# Altium schematic sheet 12_USB3_0_power.SchDoc: USB3.0 power
size A4; Organization: Lime Microsystems; Address1: Surrey Tech Centre; Address2: Guildford GU2 7YG; Address3: Surray; Address4: United Kingdom; Revision: v1.2; SheetNumber: 12; SheetTotal: 14
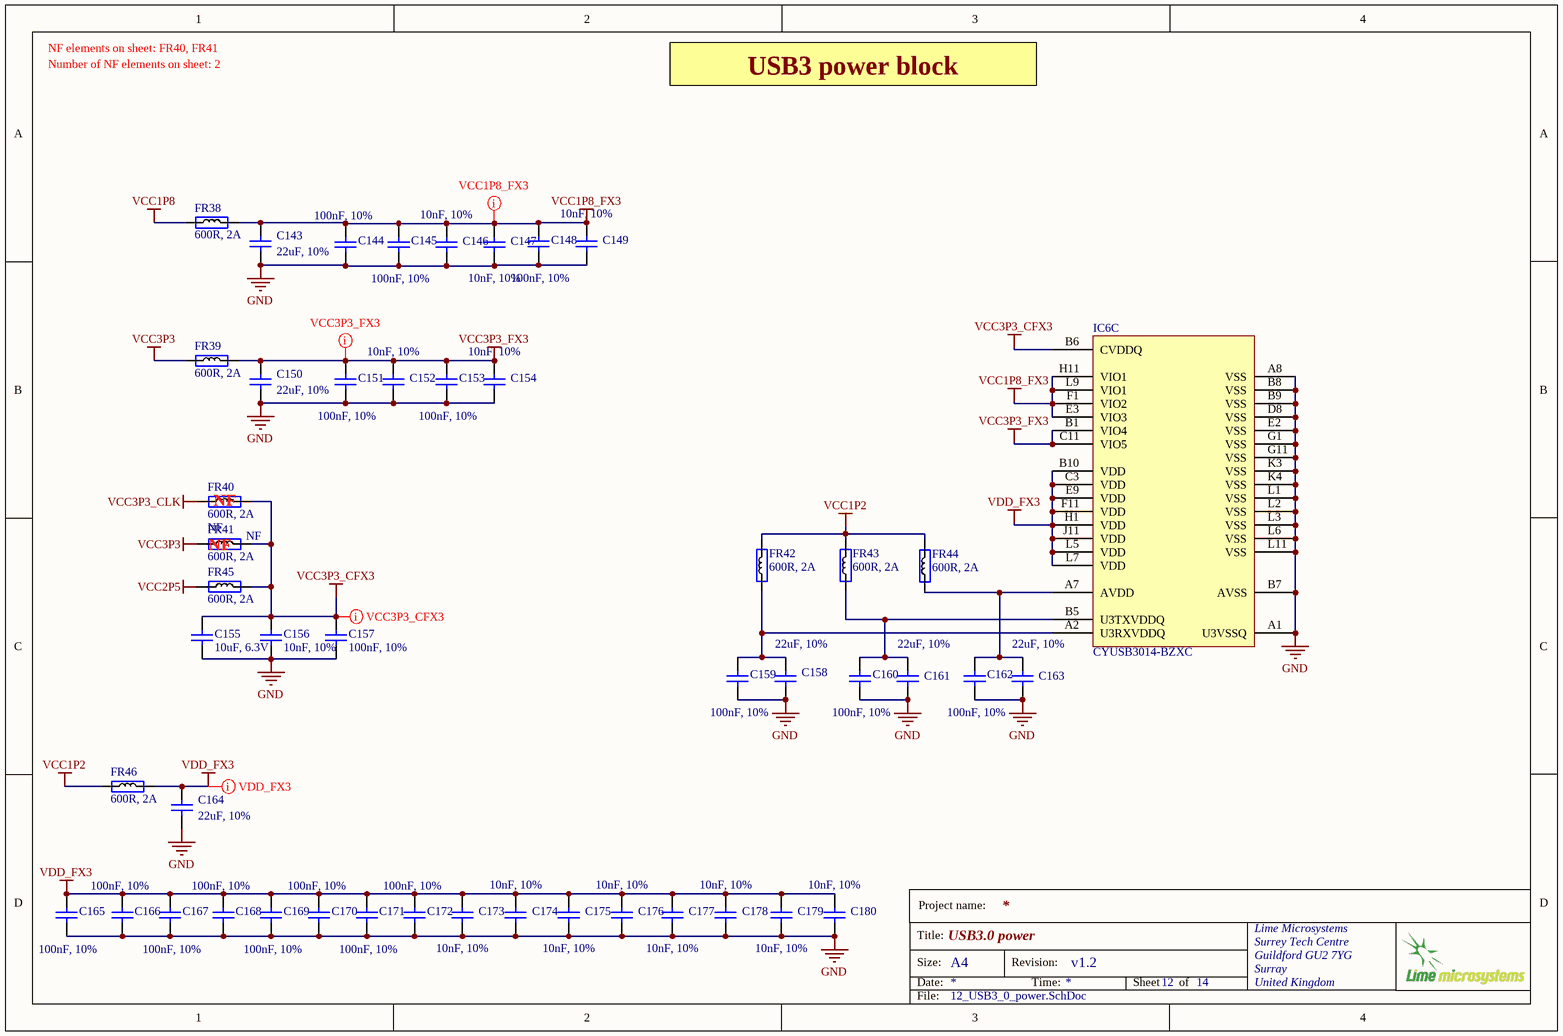
[diagram p0: 12_USB3_0_power.SchDoc]

## Parts
C143  22uF, 10%  [CAP0603]
C144  100nF, 10%  [CAP0402]
C145  100nF, 10%  [CAP0402]
C146  10nF, 10%  [CAP0402]
C147  10nF, 10%  [CAP0402]
C148  100nF, 10%  [CAP0402]
C149  10nF, 10%  [CAP0402]
C150  22uF, 10%  [CAP0603]
C151  100nF, 10%  [CAP0402]
C152  10nF, 10%  [CAP0402]
C153  100nF, 10%  [CAP0402]
C154  10nF, 10%  [CAP0402]
C155  10uF, 6.3V  [CAP0603]
C156  10nF, 10%  [CAP0402]
C157  100nF, 10%  [CAP0402]
C158  22uF, 10%  [CAP0603]
C159  100nF, 10%  [CAP0402]
C160  100nF, 10%  [CAP0402]
C161  22uF, 10%  [CAP0603]
C162  100nF, 10%  [CAP0402]
C163  22uF, 10%  [CAP0603]
C164  22uF, 10%  [CAP0603]
C165  100nF, 10%  [CAP0402]
C166  100nF, 10%  [CAP0402]
C167  100nF, 10%  [CAP0402]
C168  100nF, 10%  [CAP0402]
C169  100nF, 10%  [CAP0402]
C170  100nF, 10%  [CAP0402]
C171  100nF, 10%  [CAP0402]
C172  100nF, 10%  [CAP0402]
C173  10nF, 10%  [CAP0402]
C174  10nF, 10%  [CAP0402]
C175  10nF, 10%  [CAP0402]
C176  10nF, 10%  [CAP0402]
C177  10nF, 10%  [CAP0402]
C178  10nF, 10%  [CAP0402]
C179  10nF, 10%  [CAP0402]
C180  10nF, 10%  [CAP0402]
FR38  600R, 2A  [RES0805]
FR39  600R, 2A  [RES0805]
FR40  600R, 2A  Assembly Info: NF  [RES0805]
FR41  600R, 2A  Assembly Info: NF  [RES0805]
FR42  600R, 2A  [RES0805]
FR43  600R, 2A  [RES0805]
FR44  600R, 2A  [RES0805]
FR45  600R, 2A  [RES0805]
FR46  600R, 2A  [RES0805]
IC6  CYUSB3014-BZXC  [CYP-BZX121]  (part C of 3)

## Nets
GND: C143.1 C144.2 C145.2 C146.1 C147.1 C148.2 C149.1 C150.1 C151.2 C152.1 C153.2 C154.1 C155.1 C156.1 C157.2 C158.1 C159.2 C160.2 C161.1 C162.2 C163.1 C164.1 C165.2 C166.2 C167.2 C168.2 C169.2 C170.2 C171.2 C172.2 C173.1 C174.1 C175.1 C176.1 C177.1 C178.1 C179.1 C180.1 IC6.A1(U3VSSQ) IC6.A8(VSS) IC6.B7(AVSS) IC6.B8(VSS) IC6.B9(VSS) IC6.D8(VSS) IC6.E2(VSS) IC6.G1(VSS) IC6.G11(VSS) IC6.K3(VSS) IC6.K4(VSS) IC6.L1(VSS) IC6.L2(VSS) IC6.L3(VSS) IC6.L6(VSS) IC6.L11(VSS)
VCC1P2: FR42.2 FR43.2 FR44.2 FR46.1
VCC1P8: FR38.1
VCC1P8_FX3: C143.2 C144.1 C145.1 C146.2 C147.2 C148.1 C149.2 FR38.2 IC6.E3(VIO3) IC6.F1(VIO2) IC6.H11(VIO1) IC6.L9(VIO1)
VCC2P5: FR45.2
VCC3P3: FR39.1 FR41.2
VCC3P3_CFX3: C155.2 C156.2 C157.1 FR40.1 FR41.1 FR45.1 IC6.B6(CVDDQ)
VCC3P3_CLK: FR40.2
VCC3P3_FX3: C150.2 C151.1 C152.2 C153.1 C154.2 FR39.2 IC6.B1(VIO4) IC6.C11(VIO5)
VDD_FX3: C164.2 C165.1 C166.1 C167.1 C168.1 C169.1 C170.1 C171.1 C172.1 C173.2 C174.2 C175.2 C176.2 C177.2 C178.2 C179.2 C180.2 FR46.2 IC6.B10(VDD) IC6.C3(VDD) IC6.E9(VDD) IC6.F11(VDD) IC6.H1(VDD) IC6.J11(VDD) IC6.L5(VDD) IC6.L7(VDD)
NetC158_2: C158.2 C159.1 FR42.1 IC6.A2(U3RXVDDQ)
NetC160_1: C160.1 C161.2 FR43.1 IC6.B5(U3TXVDDQ)
NetC162_1: C162.1 C163.2 FR44.1 IC6.A7(AVDD)

## Layout directives
net class VCC1P8_FX3: VCC1P8_FX3
net class VCC3P3_FX3: VCC3P3_FX3
net class VCC3P3_CFX3: VCC3P3_CFX3
net class VDD_FX3: VDD_FX3

## Notes on the sheet
- Number of NF elements on sheet: 2
- NF elements on sheet: FR40, FR41
- USB3 power block
- (near FR40) NF
- (near FR41) NF
- Project name:
- Title:
- Size:
- Date:
- A4
- Revision:
- Time:
- Sheet
- of
- File:

## Library data of the parts
C143 C150 C158 C161 C163 C164 = Cap_0603: Manufacturer Part Number 1: C1608X5R1A226M080AC; Part Description: 22µF ±20% 10V X5R Ceramic Capacitor -55°C ~ 85°C Surface Mount, MLCC 0603 (1608 Metric) 0.063" L x 0.031" W (1.60mm x 0.80mm); Voltage Rating DC: 10 V; Brand: TDK; Temperature Coefficient / Code: +/- 15 %; Tolerance: 20 %; Type: Multilayer Ceramic Chip Capacitor; Supplier 1: Mouser; Supplier Part Number 1: 810-C1608X5R1A226M; Package / Case: 0603 (1608 metric); Category: Multilayer Ceramic Capacitors MLCC - SMD/SMT; Capacitance: 22 uF; Operating Temperature Range: - 55 C to + 85 C; Case Code - in: 0603; Case Code - mm: 1608; Value: 22uF, 10%
C144 C145 C148 C151 C153 C157 C159 C160 C162 C165-C172 = Cap_0603: Manufacturer Part Number 1: GRM155R71C104KA88D; Part Description: 0.10µF ±10% 16V X7R Ceramic Capacitor -55°C ~ 125°C Surface Mount, MLCC 0402 (1005 Metric) 0.039" L x 0.020" W (1.00mm x 0.50mm); Brand: Murata Electronics; Type: General Purpose MLCC; Capacitance: 0.1 uF; Temperature Coefficient / Code: +/- 15 %; Voltage Rating DC: 16 V; Supplier 1: Mouser; Supplier Part Number 1: 81-GRM155R71C104KA88; Tolerance: 10 %; Case Code - in: 0402; Manufacturer: Murata Electronics; Category: Multilayer Ceramic Capacitors MLCC - SMD/SMT; Value: 100nF, 10%; Manufacturer Part Number: GRM155R71C104KA88D
C146 C147 C149 C152 C154 C156 C173-C180 = Cap_0603: Part Description: 10000pF ±10% 50V X7R Ceramic Capacitor -55°C ~ 125°C Surface Mount, MLCC 0402 (1005 Metric) 0.039" L x 0.020" W (1.00mm x 0.50mm); Manufacturer: Yageo; Capacitance: 10000pF; Voltage - Rated: 50V; Supplier 1: Digi-Key; Supplier Part Number 1: 311-1349-2-ND; Category: Capacitors; Package / Case: 0402 (1005 Metric); Tolerance: ±10%; Value: 10nF, 10%
C155 = Cap_0603: Manufacturer Part Number 1: CC0603MRX5R5BB106; Part Description: 10µF ±20% 6.3V X5R Ceramic Capacitor -55°C ~ 85°C Surface Mount, MLCC 0603 (1608 Metric) 0.063" L x 0.031" W (1.60mm x 0.80mm); Manufacturer: Yageo; Capacitance: 10µF; Tolerance: ±20%; Supplier 1: Digi-Key; Supplier Part Number 1: 311-1448-2-ND; Package / Case: 0603 (1608 Metric); Category: Capacitors; Voltage - Rated: 6.3V; Value: 10uF, 6.3V
FR38-FR46 = Ferrite: Manufacturer Part Number 1: MPZ2012S601A; Manufacturer: TDK; Part Description: FERRITE BEAD 600 OHM 0805 1LN; Impedance Tolerance: ± 25%; Impedance @ 100MHz: 600; Ferrite Mounting: SMD; DC Resistance Max: 0.1; DC Current Rating: 2; Ferrite Case Style: 0805 [2012 Metric]; Supplier 1: Farnell; Supplier Part Number 1: 1669753RL; Supplier: Farnell; Core Material: Ferrite; Value: 600R, 2A
IC6 = CYUSB3014-BZXC: EZ-USB(R) FX3: SuperSpeed USB Controller, 512 KB, 60 I/Os, 0 to 70 degC, 121-Pin FBGA (BZX121); Manufacturer: Cypress Semiconductor Corp; CPU Core: ARM926 EJ-S; Max. Operating Voltage (V): 1.25; Memory Architecture: SRAM; Memory Size (KB): 512; Min. Operating Voltage (V): 1.15; No. of I/Os: 60; DatasheetVersion: Rev. *O; PackageVersion: Rev. *D; PackageReference: BZX121; PackageDescription: 121-Ball FBGA, Body 10 x 10 mm, Pitch 0.8 mm; Supplier 1: Digi-Key; Supplier Part Number 1: 428-3182-ND; Supplier 2: Farnell; Supplier Part Number 2: 2355789; Supplier 3: Newark; Supplier Part Number 3: 54W7901; Supplier 4: Mouser; Supplier Part Number 4: 727-CYUSB3014-BZXC; Max. Operating Temp. (degreesC): 70; Min. Operating Temp. (degreesC): 0; RoHS: Pb-Free; Mounting Technology: Surface Mount; Code_JEDEC: PUB 95; PartNumber: CYUSB3014-BZXC; ComponentLink1Description: Manufacturer URL; ComponentLink1URL: http://www.cypress.com/; ComponentLink2Description: Datasheet; ComponentLink2URL: http://www.cypress.com/?docID=49087; ComponentLink3Description: Package Specification; ComponentLink3URL: http://www.cypress.com/?docID=45795; Part Description: EZ-USB(R) FX3: SuperSpeed USB Controller, 512 KB, 60 I/Os, 0 to 70 degC, 121-Pin FBGA (BZX121)